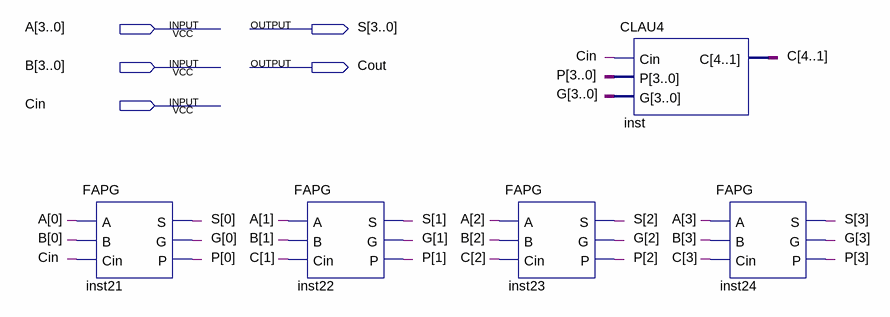
[diagram p0: schematic sheet]
// Quartus schematic CLA4.bdf as structural Verilog: 5 symbols, 5 pins
module CLA4 (
  input  [3:0] A,
  input  [3:0] B,
  input  Cin,
  output [3:0] S,
  output Cout
);

  wire [3:0] G, P;
  wire [4:1] C;

  FAPG inst21 (.A(A[0]), .B(B[0]), .Cin(Cin), .S(S[0]), .G(G[0]), .P(P[0]));
  FAPG inst22 (.A(A[1]), .B(B[1]), .Cin(C[1]), .S(S[1]), .G(G[1]), .P(P[1]));
  FAPG inst23 (.A(A[2]), .B(B[2]), .Cin(C[2]), .S(S[2]), .G(G[2]), .P(P[2]));
  CLAU4 inst (.Cin(Cin), .P(P), .G(G), .C(C));
  FAPG inst24 (.A(A[3]), .B(B[3]), .Cin(C[3]), .S(S[3]), .G(G[3]), .P(P[3]));
endmodule
